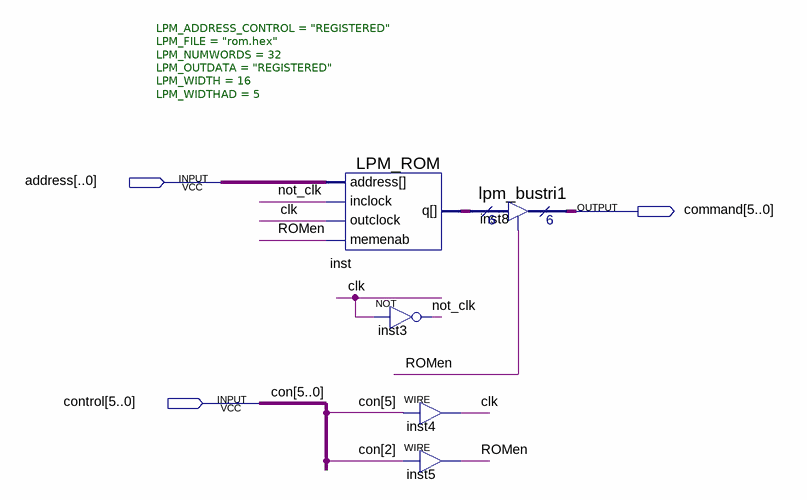
[diagram p0: schematic sheet]
// Quartus schematic rom_block.bdf as structural Verilog: 5 symbols, 3 pins
module rom_block (
  input  \address[..0] ,
  input  [5:0] control,
  output [5:0] command
);

  wire clk, not_clk, ROMen;
  wire [4:0] undriven;
  wire [15:0] inst_q;

  LPM_ROM #(.LPM_ADDRESS_CONTROL("REGISTERED"), .LPM_FILE("rom.hex"), .LPM_NUMWORDS(32), .LPM_OUTDATA("REGISTERED"), .LPM_WIDTH(16), .LPM_WIDTHAD(5)) inst (
    .address(undriven), .inclock(not_clk), .outclock(clk), .memenab(ROMen), .q(inst_q));
  not inst3 (not_clk, clk);
  assign clk = control[5];  // WIRE inst4
  assign ROMen = control[2];  // WIRE inst5
  lpm_bustri1 inst8 (.enabledt(ROMen), .data(inst_q), .tridata(command));

  // Other names for the same wires on the sheet: con[5:0] = control
endmodule
